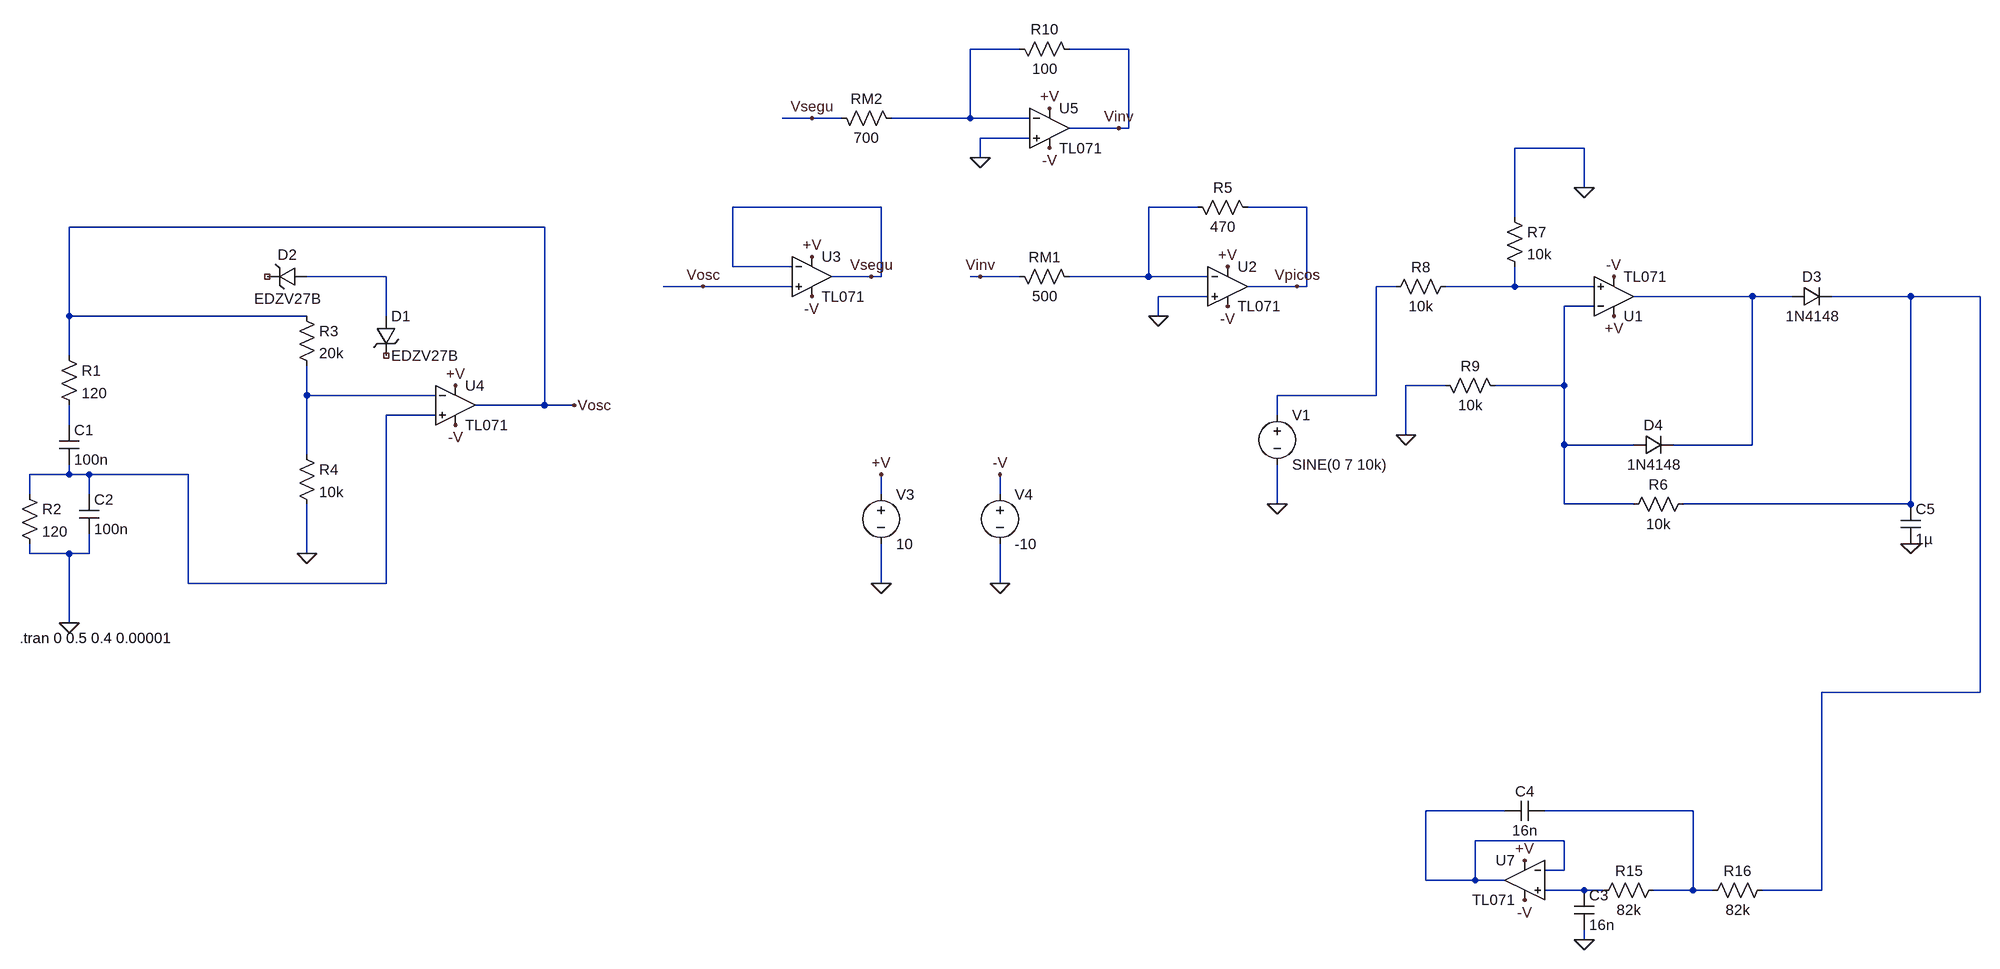
[diagram p0: schematic Circuito.asc]
Circuito.asc, the LTspice schematic file:
Version 4
SHEET 1 2420 1204
WIRE 864 -352 784 -352
WIRE 1040 -352 944 -352
WIRE 528 -240 480 -240
WIRE 576 -240 528 -240
WIRE 784 -240 784 -352
WIRE 784 -240 656 -240
WIRE 880 -240 784 -240
WIRE 1024 -224 944 -224
WIRE 1040 -224 1040 -352
WIRE 1040 -224 1024 -224
WIRE 880 -208 800 -208
WIRE 1776 -192 1664 -192
WIRE 800 -176 800 -208
WIRE 1776 -128 1776 -192
WIRE 640 -96 400 -96
WIRE 1152 -96 1072 -96
WIRE 1328 -96 1232 -96
WIRE 1664 -80 1664 -192
WIRE 96 -64 -672 -64
WIRE 400 0 400 -96
WIRE 496 0 400 0
WIRE -160 16 -288 16
WIRE 624 16 560 16
WIRE 640 16 640 -96
WIRE 640 16 624 16
WIRE 800 16 784 16
WIRE 864 16 800 16
WIRE 1072 16 1072 -96
WIRE 1072 16 944 16
WIRE 1168 16 1072 16
WIRE 352 32 288 32
WIRE 496 32 352 32
WIRE 1312 32 1232 32
WIRE 1328 32 1328 -96
WIRE 1328 32 1312 32
WIRE 1472 32 1440 32
WIRE 1664 32 1664 0
WIRE 1664 32 1552 32
WIRE 1792 32 1664 32
WIRE 1168 48 1088 48
WIRE 2048 48 1856 48
WIRE 2112 48 2048 48
WIRE 2304 48 2176 48
WIRE 2416 48 2304 48
WIRE 1792 64 1744 64
WIRE -672 80 -672 -64
WIRE -288 80 -672 80
WIRE -160 80 -160 16
WIRE 1088 80 1088 48
WIRE -672 144 -672 80
WIRE 1552 192 1488 192
WIRE 1744 192 1744 64
WIRE 1744 192 1632 192
WIRE -288 208 -288 160
WIRE -80 208 -288 208
WIRE 1440 208 1440 32
WIRE 1440 208 1280 208
WIRE 96 224 96 -64
WIRE 96 224 -16 224
WIRE 144 224 96 224
WIRE -80 240 -160 240
WIRE 1280 240 1280 208
WIRE -672 256 -672 224
WIRE 1488 272 1488 192
WIRE 1744 288 1744 192
WIRE 1856 288 1744 288
WIRE 2048 288 2048 48
WIRE 2048 288 1920 288
WIRE -288 304 -288 208
WIRE -672 336 -672 320
WIRE -672 336 -736 336
WIRE -640 336 -672 336
WIRE -480 336 -640 336
WIRE -736 368 -736 336
WIRE -640 368 -640 336
WIRE 640 368 640 336
WIRE 832 368 832 336
WIRE 1280 384 1280 320
WIRE 1744 384 1744 288
WIRE 1856 384 1744 384
WIRE 2304 384 2304 48
WIRE 2304 384 1936 384
WIRE -736 464 -736 448
WIRE -672 464 -736 464
WIRE -640 464 -640 432
WIRE -640 464 -672 464
WIRE -288 464 -288 384
WIRE -480 512 -480 336
WIRE -160 512 -160 240
WIRE -160 512 -480 512
WIRE 640 512 640 448
WIRE 832 512 832 448
WIRE -672 576 -672 464
WIRE 2416 688 2416 48
WIRE 2416 688 2160 688
WIRE 1648 880 1520 880
WIRE 1952 880 1712 880
WIRE 1744 928 1600 928
WIRE 1744 976 1744 928
WIRE 1744 976 1712 976
WIRE 1520 992 1520 880
WIRE 1600 992 1600 928
WIRE 1600 992 1520 992
WIRE 1648 992 1600 992
WIRE 1776 1008 1712 1008
WIRE 1808 1008 1776 1008
WIRE 1952 1008 1952 880
WIRE 1952 1008 1888 1008
WIRE 1984 1008 1952 1008
WIRE 2160 1008 2160 688
WIRE 2160 1008 2064 1008
WIRE 1776 1088 1776 1072
FLAG -672 576 0
FLAG -288 464 0
FLAG 1776 1088 0
FLAG 1088 80 0
FLAG 1776 -128 0
FLAG 1488 272 0
FLAG 2304 448 0
FLAG 1824 16 -V
FLAG 1824 80 +V
FLAG 1200 64 -V
FLAG 1200 0 +V
FLAG 1312 32 Vpicos
FLAG 640 512 0
FLAG 832 512 0
FLAG 832 336 -V
FLAG 640 336 +V
FLAG -48 256 -V
FLAG -48 192 +V
FLAG 528 48 -V
FLAG 528 -16 +V
FLAG 144 224 Vosc
FLAG 352 32 Vosc
FLAG 800 -176 0
FLAG 912 -192 -V
FLAG 912 -256 +V
FLAG 528 -240 Vsegu
FLAG 624 16 Vsegu
FLAG 800 16 Vinv
FLAG 1024 -224 Vinv
FLAG 1680 1024 -V
FLAG 1680 960 +V
FLAG 1280 384 0
SYMBOL cap -688 256 R0
SYMATTR InstName C1
SYMATTR Value 100n
SYMBOL cap -656 368 R0
SYMATTR InstName C2
SYMATTR Value 100n
SYMBOL res -688 128 R0
SYMATTR InstName R1
SYMATTR Value 120
SYMBOL res -752 352 R0
SYMATTR InstName R2
SYMATTR Value 120
SYMBOL res -304 64 R0
SYMATTR InstName R3
SYMATTR Value 20k
SYMBOL res -304 288 R0
SYMATTR InstName R4
SYMATTR Value 10k
SYMBOL zener -176 80 R0
SYMATTR InstName D1
SYMATTR Value EDZV27B
SYMBOL zener -288 0 R90
WINDOW 0 -4 32 VBottom 2
WINDOW 3 36 32 VTop 2
SYMATTR InstName D2
SYMATTR Value EDZV27B
SYMBOL res 1904 992 R90
WINDOW 0 0 56 VBottom 2
WINDOW 3 32 56 VTop 2
SYMATTR InstName R15
SYMATTR Value 82k
SYMBOL cap 1760 1008 R0
SYMATTR InstName C3
SYMATTR Value 16n
SYMBOL res 2080 992 R90
WINDOW 0 0 56 VBottom 2
WINDOW 3 32 56 VTop 2
SYMATTR InstName R16
SYMATTR Value 82k
SYMBOL cap 1712 864 R90
WINDOW 0 0 32 VBottom 2
WINDOW 3 32 32 VTop 2
SYMATTR InstName C4
SYMATTR Value 16n
SYMBOL Opamps\\TL071 -48 160 R0
SYMATTR InstName U4
SYMBOL res 1136 -112 M90
WINDOW 0 0 56 VBottom 2
WINDOW 3 32 56 VTop 2
SYMATTR InstName R5
SYMATTR Value 470
SYMBOL res 848 0 M90
WINDOW 0 0 56 VBottom 2
WINDOW 3 32 56 VTop 2
SYMATTR InstName RM1
SYMATTR Value 500
SYMBOL diode 2112 32 M90
WINDOW 0 0 32 VBottom 2
WINDOW 3 32 32 VTop 2
SYMATTR InstName D3
SYMATTR Value 1N4148
SYMBOL diode 1856 272 M90
WINDOW 0 0 32 VBottom 2
WINDOW 3 32 32 VTop 2
SYMATTR InstName D4
SYMATTR Value 1N4148
SYMBOL res 1952 368 R90
WINDOW 0 0 56 VBottom 2
WINDOW 3 32 56 VTop 2
SYMATTR InstName R6
SYMATTR Value 10k
SYMBOL cap 2288 384 R0
SYMATTR InstName C5
SYMATTR Value 1µ
SYMBOL res 1648 -96 R0
SYMATTR InstName R7
SYMATTR Value 10k
SYMBOL res 1568 16 R90
WINDOW 0 0 56 VBottom 2
WINDOW 3 32 56 VTop 2
SYMATTR InstName R8
SYMATTR Value 10k
SYMBOL res 1536 176 M90
WINDOW 0 0 56 VBottom 2
WINDOW 3 32 56 VTop 2
SYMATTR InstName R9
SYMATTR Value 10k
SYMBOL Opamps\\TL071 1824 112 M180
SYMATTR InstName U1
SYMBOL Opamps\\TL071 1200 -32 R0
SYMATTR InstName U2
SYMBOL voltage 640 352 R0
WINDOW 123 0 0 Left 2
WINDOW 39 0 0 Left 2
SYMATTR InstName V3
SYMATTR Value 10
SYMBOL voltage 832 352 R0
WINDOW 123 0 0 Left 2
WINDOW 39 0 0 Left 2
SYMATTR InstName V4
SYMATTR Value -10
SYMBOL Opamps\\TL071 528 -48 R0
SYMATTR InstName U3
SYMBOL res 848 -368 M90
WINDOW 0 0 56 VBottom 2
WINDOW 3 32 56 VTop 2
SYMATTR InstName R10
SYMATTR Value 100
SYMBOL res 560 -256 M90
WINDOW 0 0 56 VBottom 2
WINDOW 3 32 56 VTop 2
SYMATTR InstName RM2
SYMATTR Value 700
SYMBOL Opamps\\TL071 912 -288 R0
SYMATTR InstName U5
SYMBOL Opamps\\TL071 1680 928 M0
SYMATTR InstName U7
SYMBOL voltage 1280 224 R0
WINDOW 123 0 0 Left 2
WINDOW 39 0 0 Left 2
SYMATTR InstName V1
SYMATTR Value SINE(0 7 10k)
TEXT -752 600 Left 2 !.tran 0 0.5 0.4 0.00001

The netlist it stands for:
* Circuito.asc
C1 N011 N010 100n
C2 N010 0 100n
R1 Vosc N011 120
R2 N010 0 120
R3 Vosc N009 20k
R4 N009 0 10k
D1 N003 NC_01 EDZV27B
D2 N003 NC_02 EDZV27B
R15 N013 N014 82k
C3 N014 0 16n
R16 N007 N013 82k
C4 N013 N012 16n
XU4 N010 N009 +V -V Vosc TL071  ; pins In+ In- V+ V- OUT
R5 N002 Vpicos 470
RM1 Vinv N002 500
D3 N006 N007 1N4148
D4 N008 N006 1N4148
R6 N007 N008 10k
C5 N007 0 1µ
R7 0 N005 10k
R8 N005 N004 10k
R9 0 N008 10k
XU1 N005 N008 +V -V N006 TL071  ; pins In+ In- V+ V- OUT
XU2 0 N002 +V -V Vpicos TL071  ; pins In+ In- V+ V- OUT
V3 +V 0 10
V4 -V 0 -10
XU3 Vosc Vsegu +V -V Vsegu TL071  ; pins In+ In- V+ V- OUT
R10 N001 Vinv 100
RM2 Vsegu N001 700
XU5 0 N001 +V -V Vinv TL071  ; pins In+ In- V+ V- OUT
XU7 N014 N012 +V -V N012 TL071  ; pins In+ In- V+ V- OUT
V1 N004 0 SINE(0 7 10k)
.model D D
.lib standard.dio
.tran 0 0.5 0.4 0.00001
.backanno
.end